# Altium project Telephone.PrjPcb (part 1 of 6)
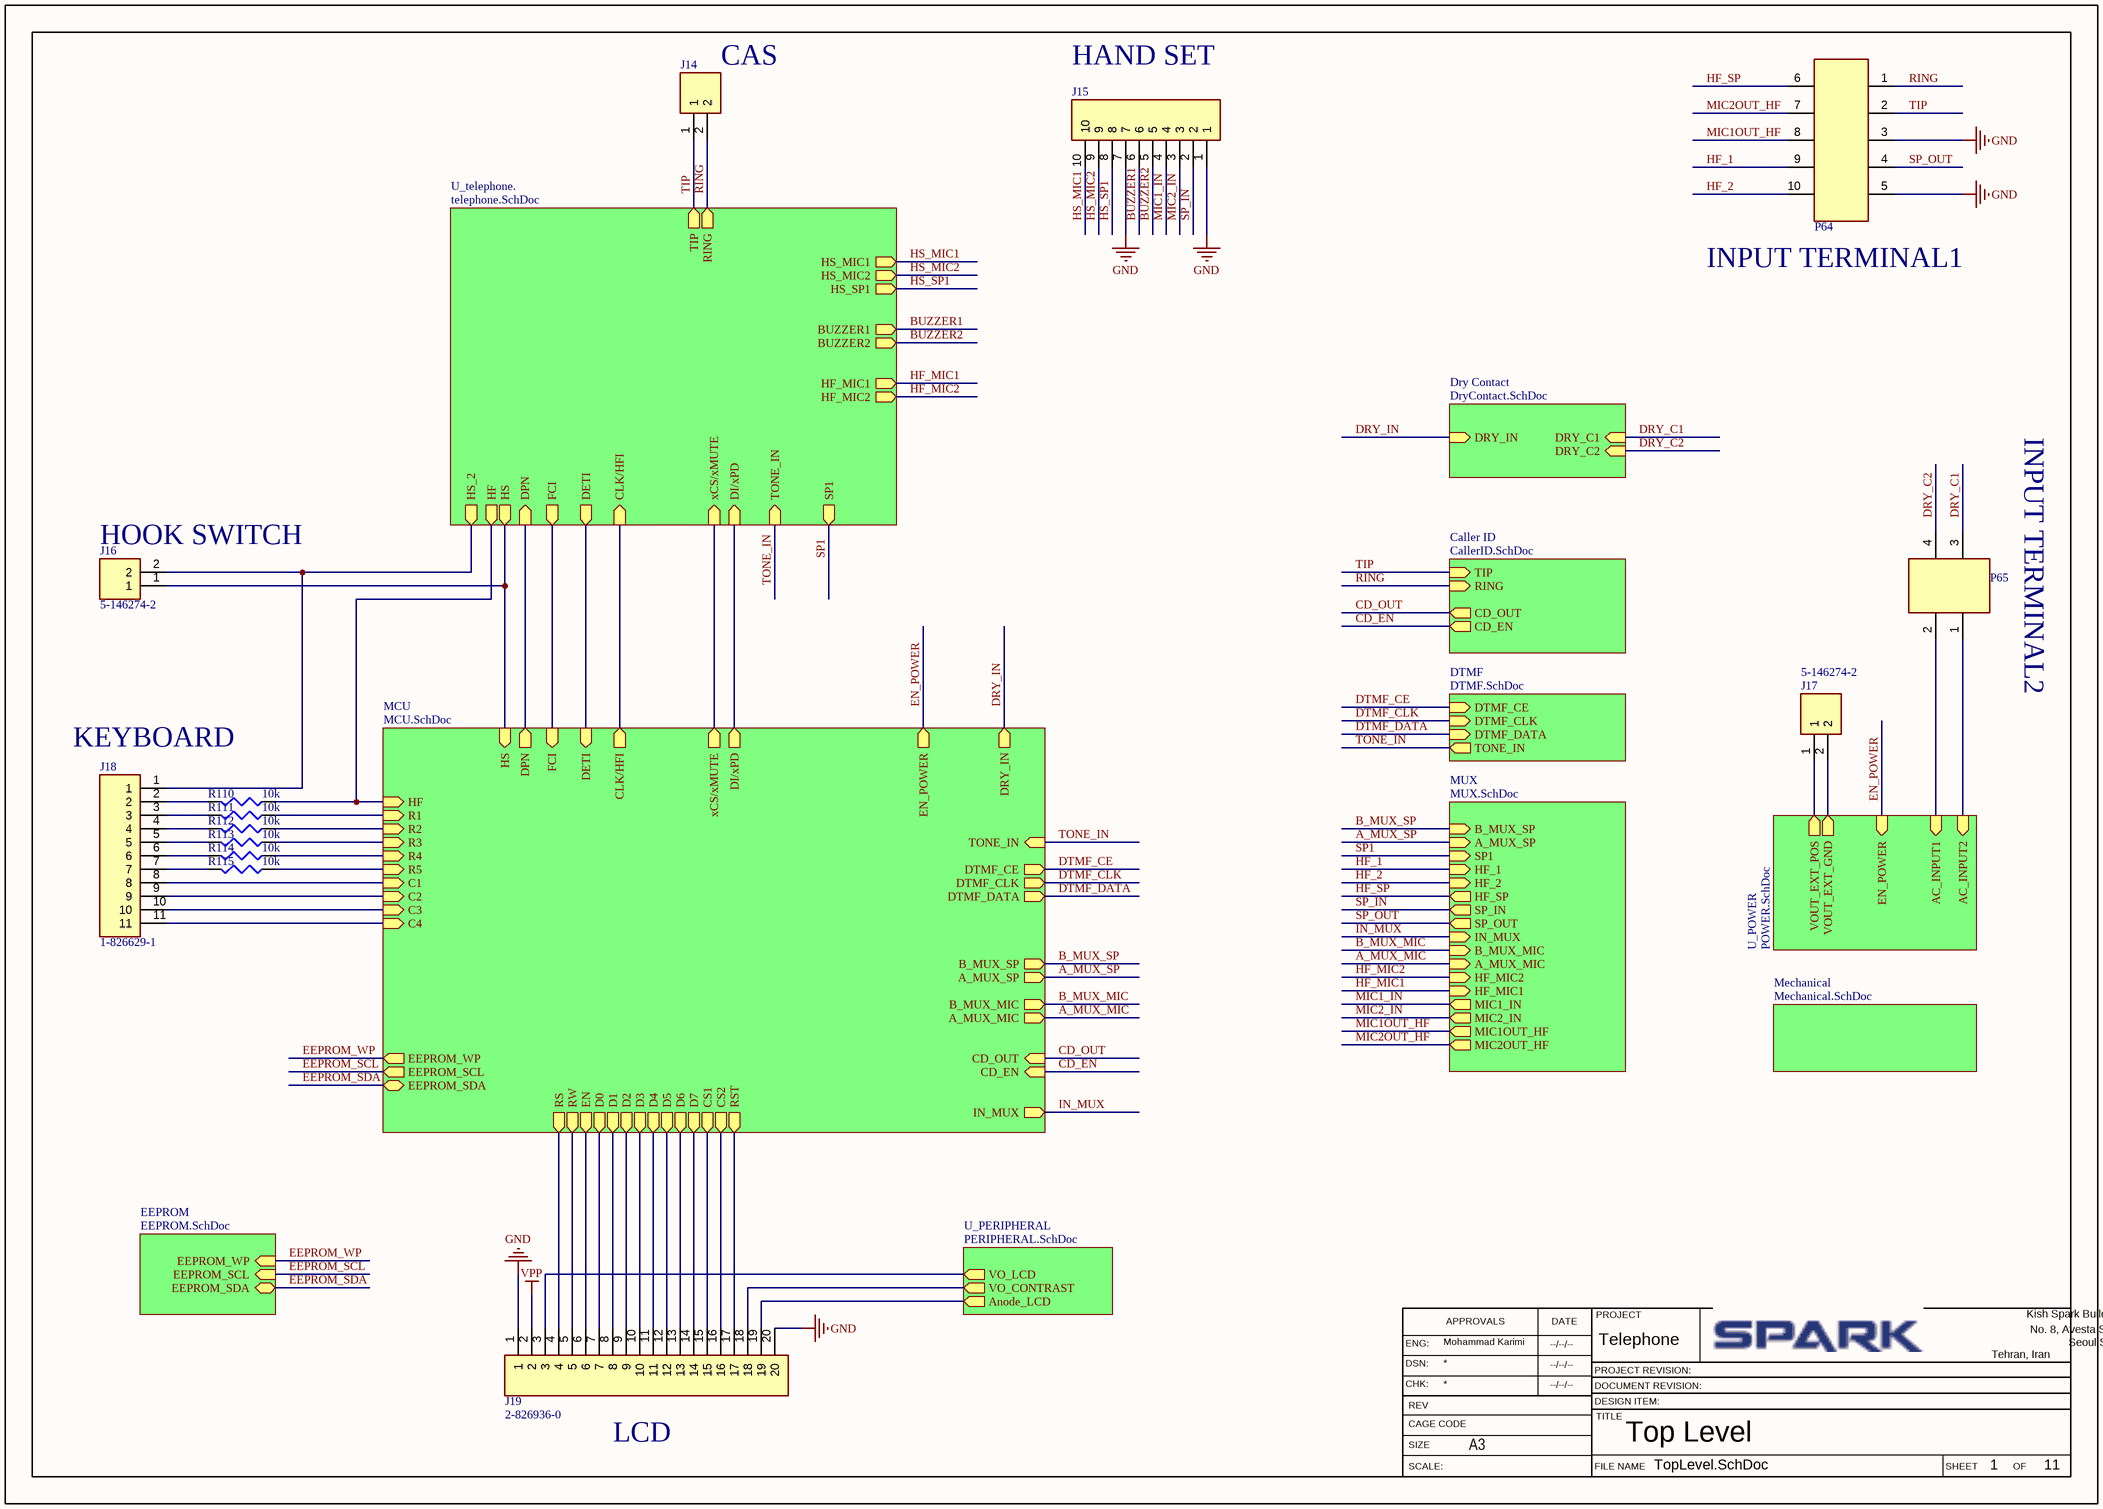
[diagram p0: TopLevel.SchDoc]
Engineer: Mohammad Karimi; Project: Telephone
11 sheets, 364 parts. Net scope: hierarchical (ports join the sheet entries above them; power ports are global).
Board file: PCB.PcbDoc
Sheets:
  TopLevel.SchDoc
    Dry Contact = DryContact.SchDoc
    U_telephone. = Telephone.SchDoc
    MCU = MCU.SchDoc
    U_POWER = Power.SchDoc
    U_PERIPHERAL = Peripheral.SchDoc
    Mechanical = Mechanical.SchDoc
    EEPROM = EEPROM.SchDoc
    Caller ID = CallerID.SchDoc
    DTMF = DTMF.SchDoc
    MUX = MUX.SchDoc

## Sheet TopLevel.SchDoc: Top Level
size A3; Organization: ORGANIZATION; Address1: ADDRESS 1; Address2: ADDRESS 2; Address3: ADDRESS 3; Address4: ADDRESS 4; Revision: -; SheetNumber: 1; SheetTotal: 11; ENG_APP_DATE: --/--/--; DSN_APP_DATE: --/--/--; CHK_APP_DATE: --/--/--

### Parts
J14  5-146274-2  [TE_5-146274-2]  (value not drawn)
J15  146443-5  [146443-5]  (value not drawn)
J16  5-146274-2  [TE_5-146274-2]
J17  5-146274-2  [TE_5-146274-2]
J18  1-826629-1  [1-826629-1]
J19  2-826936-0  [2-826936-0]
P64  66201021122  [POWER 10 PIN]  (value not drawn)
P65  66200421122  [power-4pin]  (value not drawn)
R110  value 10k  [R0603]  (hidden comment: CRCW060310K0JNEA)
R111  value 10k  [R0603]  (hidden comment: CRCW060310K0JNEA)
R112  value 10k  [R0603]  (hidden comment: CRCW060310K0JNEA)
R113  value 10k  [R0603]  (hidden comment: CRCW060310K0JNEA)
R114  value 10k  [R0603]  (hidden comment: CRCW060310K0JNEA)
R115  value 10k  [R0603]  (hidden comment: CRCW060310K0JNEA)

### Sub-sheets
Caller ID = CallerID.SchDoc: CD_OUT (out), TIP (in), RING (in), CD_EN (out)
Dry Contact = DryContact.SchDoc: DRY_C2 (in), DRY_C1 (in), DRY_IN (in)
DTMF = DTMF.SchDoc: DTMF_CE (in), DTMF_CLK (in), DTMF_DATA (in), TONE_IN (out)
EEPROM = EEPROM.SchDoc: EEPROM_WP (in), EEPROM_SCL (in), EEPROM_SDA (bidir)
MCU = MCU.SchDoc: DI/xPD (out), xCS/xMUTE (out), DPN (out), CLK/HFI (out), DETI (in), DTMF_CE (out), DTMF_CLK (out), DTMF_DATA (out), TONE_IN (in), R1 (in), R2 (in), R3 (in), R4 (in), R5 (in), C1 (in), C2 (in), C3 (in), C4 (in), HF (in), HS (in), FCI (in), B_MUX_SP (out), A_MUX_SP (out), B_MUX_MIC (out), A_MUX_MIC (out), CD_EN (in), CD_OUT (in), CS2 (out), D4 (out), D5 (out), EN (out), D6 (out), D2 (out), CS1 (out), D3 (out), D1 (out), RS (out), D0 (out), RST (out), D7 (out), RW (out), DRY_IN (out), EN_POWER (out), IN_MUX (out), EEPROM_WP (out), EEPROM_SCL (out), EEPROM_SDA (bidir)
Mechanical = Mechanical.SchDoc: no entries
MUX = MUX.SchDoc: B_MUX_SP (in), A_MUX_SP (in), SP1 (in), HF_1 (in), HF_2 (in), HF_SP (out), SP_IN (out), SP_OUT (out), IN_MUX (in), B_MUX_MIC (in), A_MUX_MIC (in), HF_MIC2 (in), HF_MIC1 (in), MIC1_IN (out), MIC2_IN (out), MIC1OUT_HF (out), MIC2OUT_HF (out)
U_PERIPHERAL = PERIPHERAL.SchDoc: VO_LCD (out), VO_CONTRAST (out), Anode_LCD (out)
U_POWER = POWER.SchDoc: EN_POWER (in), VOUT_EXT_POS (out), AC_INPUT1 (in), AC_INPUT2 (in), VOUT_EXT_GND (out)
U_telephone. = telephone.SchDoc: HF (out), HS (out), DI/xPD (in), xCS/xMUTE (in), DPN (in), FCI (out), TONE_IN (in), DETI (out), CLK/HFI (in), TIP (out), RING (out), SP1 (out), HS_SP1 (out), HS_2 (out), BUZZER1 (out), BUZZER2 (out), HF_MIC2 (out), HF_MIC1 (out), HS_MIC1 (out), HS_MIC2 (out)

### Nets
GND: J15.1 J15.7 J19.1 J19.20 P64.3 P64.5
VPP: J19.2
A_MUX_MIC: sheet MCU/A_MUX_MIC, sheet MUX/A_MUX_MIC
A_MUX_SP: sheet MCU/A_MUX_SP, sheet MUX/A_MUX_SP
Anode_LCD: J19.19 ; sheet U_PERIPHERAL/Anode_LCD
B_MUX_MIC: sheet MCU/B_MUX_MIC, sheet MUX/B_MUX_MIC
B_MUX_SP: sheet MCU/B_MUX_SP, sheet MUX/B_MUX_SP
BUZZER1: J15.6 ; sheet U_telephone./BUZZER1
BUZZER2: J15.5 ; sheet U_telephone./BUZZER2
C1: J18.8 ; sheet MCU/C1
C2: J18.9 ; sheet MCU/C2
C3: J18.10 ; sheet MCU/C3
C4: J18.11 ; sheet MCU/C4
CD_EN: sheet MCU/CD_EN, sheet Caller ID/CD_EN
CD_OUT: sheet MCU/CD_OUT, sheet Caller ID/CD_OUT
CLK/HFI: sheet U_telephone./CLK/HFI, sheet MCU/CLK/HFI
CS1: J19.15 ; sheet MCU/CS1
CS2: J19.16 ; sheet MCU/CS2
D0: J19.7 ; sheet MCU/D0
D1: J19.8 ; sheet MCU/D1
D2: J19.9 ; sheet MCU/D2
D3: J19.10 ; sheet MCU/D3
D4: J19.11 ; sheet MCU/D4
D5: J19.12 ; sheet MCU/D5
D6: J19.13 ; sheet MCU/D6
D7: J19.14 ; sheet MCU/D7
DETI: sheet U_telephone./DETI, sheet MCU/DETI
DI/xPD: sheet U_telephone./DI/xPD, sheet MCU/DI/xPD
DPN: sheet U_telephone./DPN, sheet MCU/DPN
DRY_C1: P65.3 ; sheet Dry Contact/DRY_C1
DRY_C2: P65.4 ; sheet Dry Contact/DRY_C2
DRY_IN: sheet Dry Contact/DRY_IN, sheet MCU/DRY_IN
DTMF_CE: sheet MCU/DTMF_CE, sheet DTMF/DTMF_CE
DTMF_CLK: sheet MCU/DTMF_CLK, sheet DTMF/DTMF_CLK
DTMF_DATA: sheet MCU/DTMF_DATA, sheet DTMF/DTMF_DATA
EEPROM_SCL: sheet MCU/EEPROM_SCL, sheet EEPROM/EEPROM_SCL
EEPROM_SDA: sheet MCU/EEPROM_SDA, sheet EEPROM/EEPROM_SDA
EEPROM_WP: sheet MCU/EEPROM_WP, sheet EEPROM/EEPROM_WP
EN: J19.6 ; sheet MCU/EN
EN_POWER: sheet MCU/EN_POWER, sheet U_POWER/EN_POWER
FCI: sheet U_telephone./FCI, sheet MCU/FCI
HF: R110.1 ; sheet U_telephone./HF, sheet MCU/HF
HF_1: P64.9 ; sheet MUX/HF_1
HF_2: P64.10 ; sheet MUX/HF_2
HF_MIC1: sheet U_telephone./HF_MIC1, sheet MUX/HF_MIC1
HF_MIC2: sheet U_telephone./HF_MIC2, sheet MUX/HF_MIC2
HF_SP: P64.6 ; sheet MUX/HF_SP
HS: J16.1 ; sheet U_telephone./HS, sheet MCU/HS
HS_2: J16.2 J18.1 ; sheet U_telephone./HS_2
HS_MIC1: J15.10 ; sheet U_telephone./HS_MIC1
HS_MIC2: J15.9 ; sheet U_telephone./HS_MIC2
HS_SP1: J15.8 ; sheet U_telephone./HS_SP1
IN_MUX: sheet MCU/IN_MUX, sheet MUX/IN_MUX
MIC1_IN: J15.4 ; sheet MUX/MIC1_IN
MIC1OUT_HF: P64.8 ; sheet MUX/MIC1OUT_HF
MIC2_IN: J15.3 ; sheet MUX/MIC2_IN
MIC2OUT_HF: P64.7 ; sheet MUX/MIC2OUT_HF
R1: R111.1 ; sheet MCU/R1
R2: R112.1 ; sheet MCU/R2
R3: R113.1 ; sheet MCU/R3
R4: R114.1 ; sheet MCU/R4
R5: R115.1 ; sheet MCU/R5
RING: J14.2 P64.1 ; sheet U_telephone./RING, sheet Caller ID/RING
RS: J19.4 ; sheet MCU/RS
RST: J19.17 ; sheet MCU/RST
RW: J19.5 ; sheet MCU/RW
SP1: sheet U_telephone./SP1, sheet MUX/SP1
SP_IN: J15.2 ; sheet MUX/SP_IN
SP_OUT: P64.4 ; sheet MUX/SP_OUT
TIP: J14.1 P64.2 ; sheet U_telephone./TIP, sheet Caller ID/TIP
TONE_IN: sheet U_telephone./TONE_IN, sheet MCU/TONE_IN, sheet DTMF/TONE_IN
VO_CONTRAST: J19.18 ; sheet U_PERIPHERAL/VO_CONTRAST
VO_LCD: J19.3 ; sheet U_PERIPHERAL/VO_LCD
xCS/xMUTE: sheet U_telephone./xCS/xMUTE, sheet MCU/xCS/xMUTE
NetJ17_1: J17.1 ; sheet U_POWER/VOUT_EXT_POS
NetJ17_2: J17.2 ; sheet U_POWER/VOUT_EXT_GND
NetJ18_2: J18.2 R110.2
NetJ18_3: J18.3 R111.2
NetJ18_4: J18.4 R112.2
NetJ18_5: J18.5 R113.2
NetJ18_6: J18.6 R114.2
NetJ18_7: J18.7 R115.2
NetP65_1: P65.1 ; sheet U_POWER/AC_INPUT2
NetP65_2: P65.2 ; sheet U_POWER/AC_INPUT1

### Notes on the sheet
- (near J14) CAS
- HAND SET
- (near P64) INPUT TERMINAL1
- INPUT TERMINAL2
- (near J16) HOOK SWITCH
- (near J18) KEYBOARD
- LCD
- APPROVALS
- DATE
- PROJECT
- Kish Spark Building
- No. 8, Avesta Street
- ENG:
- DSN:
- CHK:
- PROJECT REVISION:
- DESIGN ITEM:
- DOCUMENT REVISION:
- Tehran, Iran
- Seoul Street, Sheikh Bahaie
- SIZE
- REV
- SCALE:
- CAGE CODE
- A3
- FILE NAME
- TITLE
- SHEET
- OF

### Library data of the parts
J14 J16 J17 = CMP-002-00181-1: Conn Unshrouded Header HDR 2 POS 2.54mm Solder ST Top Entry Thru-Hole Carton; Connector Type: Plug,Header,Pin; Gender: Male; Voltage Rating: 750V; Approvals: CSA; Board Standoff: Yes (With); Contact Current Rating: 3A; Contact Post Length: 0.125inch; Contact Protection: No (Without); High Speed Serial Data Connector: No; High Temperature Housing: Yes; Max Voltage Rating (AC): 250V; Number of Contacts: 2; PCB Mount Retention: Without; PCB Mounting Orientation: Vertical; PCB Thickness: 0.062inch; Max Operating Temperature: 105°C; Min Operating Temperature: -65°C; Mounting Technology: Through Hole; RoHS Compliant: Yes; Color: Black; Contact Finish - Mating: TIN; Contact Gender: Male; Contact Material: Bronze; Contact Mating Length: 8.08mm; Contact Plating: Tin; Contact Shape: Square; Contact Type: Male Pin; Current Rating: 3A; Depth: 2.34mm; ELV: Compliant; Fastening Type: Pull; Flammability Rating: UL94 V-0; Gasket: No (Without); Housing Color: Black; Housing Material: Polymer; Insulation Color: Black; Insulation Material: Polymer; Keyed: No; Lead Free: Lead Free; Length: 2.67mm; Mating Alignment: No (Without); Mating Connector Lock: No (Without); Number of Positions: 2; Number of Rows: 1; Orientation: Straight; Package Quantity: 500; Packaging: Carton; Pitch: 2.54mm; Radiation Hardening: No; Reach SVHC Compliant: Unknown; Row Spacing: 2.54mm; Selectively Loaded: No (Without); Series: AMPMODU MOD II; Stabilizers: No (Without); Strain Relief: No (Without); Termination: Through Hole
J15 = CMP-002-00182-1: Conn Unshrouded Header HDR 10 POS 2.54mm Solder ST Thru-Hole Carton; Connector Type: Plug,Header,Pin; Board Standoff: No (Without); High Speed Serial Data Connector: No; Number of Contacts: 10; PCB Mount Retention: Without; PCB Mounting Orientation: Vertical; Plating Thickness: 5um; Mounting Technology: Surface Mount; RoHS Compliant: No; Contact Finish - Mating: GOLD; Contact Material: Copper Alloy; Contact Mating Length: 0.23inch; Contact Plating: Gold; Contact Protection: No (Without); Contact Shape: Square; Contact Type: Male Pin; ELV: Non-Compliant; Fastening Type: Pull; Gasket: No (Without); High Temperature Compatible: No; High Temperature Housing: No; Housing Color: Black; Housing Material: Thermoplastic; Keyed: No; Mating Alignment: No (Without); Mating Connector Lock: No (Without); Number of Positions: 10; Number of Rows: 2; Orientation: Vertical; Package Quantity: 320; Packaging: Carton; Pitch: 2.54mm; Radiation Hardening: No; Row Spacing: 2.54mm; Sealable: No (Without); Selectively Loaded: No (Without); Series: AMPMODU MOD II; Stabilizers: No (Without); Strain Relief: No (Without); Termination: SMD/SMT
J18 = CMP-002-00184-1: Conn Unshrouded Header HDR 11 POS 2.54mm Solder ST Thru-Hole Carton; Connector Type: Plug,Header,Pin; Board Standoff: No (Without); Contact Post Length: 0.1259inch; High Speed Serial Data Connector: No; Number of Contacts: 11; PCB Mount Retention: Without; PCB Mounting Orientation: Vertical; Plating Thickness: 0.8um; Max Operating Temperature: 105°C; Min Operating Temperature: -65°C; Mounting Technology: Straddle Mount; RoHS Compliant: Yes; Contact Finish - Mating: GOLD; Contact Gender: Male; Contact Material: Bronze; Contact Mating Length: 6.7mm; Contact Plating: Gold,Tin; Contact Protection: No (Without); Contact Shape: Square; Contact Type: Male Pin; ELV: Compliant; Fastening Type: Pull; Flammability Rating: UL94 V-0; Gasket: No (Without); High Temperature Housing: No; Housing Color: Green; Housing Material: PBT; Insulation Color: Green; Insulation Material: PBT; Keyed: No; Mating Alignment: No (Without); Mating Connector Lock: No (Without); Number of Positions: 11; Number of Rows: 1; Orientation: Straight; Package Quantity: 500; Packaging: Carton; Pitch: 2.54mm; Radiation Hardening: No; Row Spacing: 2.54mm; Selectively Loaded: No (Without); Series: AMPMODU MOD II; Stabilizers: No (Without); Strain Relief: No (Without); Termination: Through Hole
J19 = CMP-002-00183-1: Conn Unshrouded Header HDR 20 POS 2.54mm Solder ST Thru-Hole Box; Connector Type: Plug,Header,Pin; Board Standoff: No (Without); Contact Current Rating: 5A; Contact Post Length: 0.1259inch; High Speed Serial Data Connector: No; Number of Contacts: 20; PCB Mount Retention: Without; PCB Mounting Orientation: Vertical; Plating Thickness: 2um; Max Operating Temperature: 105°C; Min Operating Temperature: -65°C; Mounting Technology: Through Hole; RoHS Compliant: Yes; Color: Green; Contact Gender: Male; Contact Material: Bronze; Contact Mating Length: 5.8mm; Contact Plating: Tin; Contact Protection: No (Without); Contact Shape: Square; Contact Type: Male Pin; ELV: Compliant; Flammability Rating: UL94 V-0; Gasket: No (Without); High Temperature Housing: No; Housing Color: Green; Housing Material: PBT; Keyed: No; Mating Alignment: No (Without); Mating Connector Lock: No (Without); Number of Positions: 20; Number of Rows: 1; Package Quantity: 300; Packaging: Box; Pitch: 2.54mm; Radiation Hardening: No; Row Spacing: 2.54mm; Selectively Loaded: No (Without); Series: AMPMODU MOD II; Stabilizers: No (Without); Strain Relief: No (Without); Termination: Through Hole
P64 = CMP-002-00178-2: WR-MPC3; 3mm Pitch 10 Way 2 Row Shrouded Straight PCB Header; Through Hole; Manufacturer: Wurth Electronics; Current Rating: 5A; Voltage Rating: 250V; Number of Positions: 10; Insulation: Insulated; Insulation Resistance: 1GR; Gender: Receptacle; Manufacturer Part Number: 66201021122; Category: Headers and Wire Housings; Mounting Technology: Through Hole; Color: Black; Contact Material: Copper Alloy,Copper; Contact Plating: Tin; Housing Material: Nylon; Contact Shape: Square; Contact Finish - Mating: TIN; Insulation Material: Polymer; Insulation Color: Black; Min Operating Temperature: -25°C; Max Operating Temperature: 105°C; Number of Rows: 2; Fastening Type: Ramp; Packaging: Tray; Contact Gender: Male; Termination: Through Hole; Number of Contacts: 10; Connector Type: Header; Series: WR-MPC3; Contact Type: Male Pin; Length: 18.7mm; Width: 18.7mm; Height: 9.9mm; Pitch: 3mm; Flammability Rating: UL94 V-0; RoHS Compliant: Yes; Reach SVHC Compliant: Unknown; ComponentLink1URL: https://datasheet.ciiva.com/8043/624425-8043421.pdf?src-supplier=Element14; ComponentLink1Description: https://datasheet.ciiva.com/8043/624425-8043421.pdf?src-supplier=Element14; ComponentLink2URL: https://datasheet.ciiva.com/731/6620xx21122-731332.pdf?src-supplier=Digi-Key; ComponentLink2Description: https://datasheet.ciiva.com/731/6620xx21122-731332.pdf?src-supplier=Digi-Key; Pins: 10; Component Type: Standard
P65 = CMP-002-00177-2: WR-MPC3 Series; 3mm Pitch 4 Way 2 Row Shrouded Straight PCB Header; Through Hole; Manufacturer: Wurth Electronics; Current Rating: 5A; Voltage Rating: 250V; Number of Positions: 4; Insulation: Insulated; Insulation Resistance: 1GR; Gender: Receptacle; Row Spacing: 0.118inch; Manufacturer Part Number: 66200421122; Category: Headers and Wire Housings; Mounting Technology: Through Hole; Color: Black; Contact Material: Copper Alloy,Copper; Contact Plating: Tin; Housing Material: Nylon; Contact Shape: Square; Contact Finish - Mating: TIN; Insulation Material: Polymer; Insulation Color: Black; Min Operating Temperature: -25°C; Max Operating Temperature: 105°C; Number of Rows: 2; Fastening Type: Ramp; Packaging: Tray; Contact Gender: Male; Termination: Through Hole; Number of Contacts: 4; Connector Type: Header; Series: WR-MPC3; Contact Type: Male Pin; Length: 9.7mm; Width: 9.7mm; Height: 9.9mm; Pitch: 3mm; Flammability Rating: UL94 V-0; RoHS Compliant: Yes; Reach SVHC Compliant: Unknown; ComponentLink1URL: https://datasheet.ciiva.com/8043/624425-8043413.pdf?src-supplier=Element14; ComponentLink1Description: https://datasheet.ciiva.com/8043/624425-8043413.pdf?src-supplier=Element14; ComponentLink2URL: https://datasheet.ciiva.com/731/6620xx21122-731329.pdf?src-supplier=Digi-Key; ComponentLink2Description: https://datasheet.ciiva.com/731/6620xx21122-731329.pdf?src-supplier=Digi-Key; Case/Package: 63; Pins: 4; Design Item ID: 66200421122; Component Type: Standard
R110-R115 = CMP-009-00213-1: Res Thick Film 0603 10K Ohm 5% 1/10W 200ppm/C Molded SMD SMD Paper T/R; Manufacturer 1: Vishay Dale; Voltage Rating: 75V; Max Power Dissipation: 100mW; Temperature Coefficient: 200ppm/°C; Case/Package: 0603; Pins: 2; RoHS Compliant: Yes; Min Operating Temperature: -55°C; Max Operating Temperature: 155°C; Tolerance: 5%; Design Item ID: CRCW060310K0JNEA; Case Code (Metric): 1608; Category: Chip SMD Resistors; Construction: Rectangular; Contact Plating: Tin; Depth: 0.85mm; Features: Automotive AEC-Q200; Height: 0.02inch; Lead Free: Lead Free; Length: 1.55mm; Manufacturer Part Number 1: CRCW060310K0JNEA; Military Standard: Not; Mount: Surface Mount; Number of Terminations: 2; Package Quantity: 1; Packaging: Tape and Reel; Power Rating: 100mW; Pricing 1: 1=0.10000, 10=0.03300, 100=0.01360, 1000=0.00610, 2500=0.00529 (USD); Radiation Hardening: No; REACH SVHC: Unknown; Resistance Tolerance: 5%; Resistor Type: Thick Film; RoHS: Yes; Series: CRCW; Size Code: 0603; Source: PTZLib.SchLib; Stock 1: 41; Termination: SMD/SMT; Voltage Rating (DC): 75V; Weight: 7.1E-05oz; Width: 0.033inch; ComponentLink1Description: https://datasheet.ciiva.com/3256/dcrcwe3-3256943.pdf?src-supplier=Avnet; ComponentLink1URL: https://datasheet.ciiva.com/3256/dcrcwe3-3256943.pdf?src-supplier=Avnet; ComponentLink2Description: https://datasheet.ciiva.com/2461/dcrcwe3-2461971.pdf?src-supplier=Digi-Key; ComponentLink2URL: https://datasheet.ciiva.com/2461/dcrcwe3-2461971.pdf?src-supplier=Digi-Key; ComponentLink3Description: https://datasheet.ciiva.com/2461/dcrcwe3-2461972.pdf?src-supplier=Digi-Key; ComponentLink3URL: https://datasheet.ciiva.com/2461/dcrcwe3-2461972.pdf?src-supplier=Digi-Key; ComponentLink4Description: https://datasheet.ciiva.com/2461/dcrcwe3-2461973.pdf?src-supplier=Digi-Key; ComponentLink4URL: https://datasheet.ciiva.com/2461/dcrcwe3-2461973.pdf?src-supplier=Digi-Key; ComponentLink5Description: https://datasheet.ciiva.com/3256/dcrcwe3-3256942.pdf?src-supplier=Avnet; ComponentLink5URL: https://datasheet.ciiva.com/3256/dcrcwe3-3256942.pdf?src-supplier=Avnet; ComponentLink6Description: https://datasheet.ciiva.com/16343/dcrcwe3-16343525.pdf?src-supplier=Future+Electronics; ComponentLink6URL: https://datasheet.ciiva.com/16343/dcrcwe3-16343525.pdf?src-supplier=Future+Electronics; ComponentLink7Description: https://datasheet.ciiva.com/16755/70201119-16755717.pdf?src-supplier=Allied+Electronics; ComponentLink7URL: https://datasheet.ciiva.com/16755/70201119-16755717.pdf?src-supplier=Allied+Electronics; ComponentLink8Description: https://datasheet.ciiva.com/16515/dcrcwe3-16515020.pdf?src-supplier=Avnet+Asia; ComponentLink8URL: https://datasheet.ciiva.com/16515/dcrcwe3-16515020.pdf?src-supplier=Avnet+Asia; ComponentLink9Description: https://datasheet.ciiva.com/16771/70201119-16771051.pdf?src-supplier=Allied+Electronics; ComponentLink9URL: https://datasheet.ciiva.com/16771/70201119-16771051.pdf?src-supplier=Allied+Electronics

## Sheet DryContact.SchDoc: Dry Contact
size A4; Organization: ORGANIZATION; Address1: ADDRESS 1; Address2: ADDRESS 2; Address3: ADDRESS 3; Address4: ADDRESS 4; Revision: -; ENG_APP_DATE: --/--/--; DSN_APP_DATE: --/--/--; CHK_APP_DATE: --/--/--
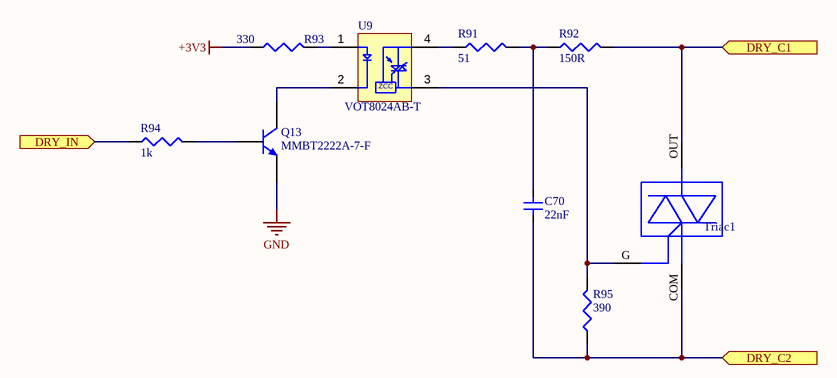
[diagram p1: DryContact.SchDoc]

### Parts
C70  value 22nF  [1206]  (hidden comment: CMP-001-00171-1)
Q13  MMBT2222A-7-F  [SOT23127P600-8N]
R91  value 51  [R0603]  (hidden comment: CMP-009-00208-1)
R92  value 150R  [R0603]  (hidden comment: CMP-009-00192-1)
R93  value 330  [R0603]  (hidden comment: RC0603FR-07330RL)
R94  value 1k  [R0603]  (hidden comment: CMP-009-00194-1)
R95  value 390  [R0603]  (hidden comment: CMP-009-00224-1)
Triac1  ACST210-8BTR  [ACST210_DPAK]  (value not drawn)
U9  VOT8024AB-T  [SW-TRIAC]

### Ports
DRY_C1 (in), DRY_C2 (in), DRY_IN (in)

### Nets
+3V3: R93.2
GND: Q13.1(E)
DRY_C1: R92.2 Triac1.OUT ; port DRY_C1
DRY_C2: C70.1 R95.1 Triac1.COM ; port DRY_C2
DRY_IN: R94.1 ; port DRY_IN
NetC70_2: C70.2 R91.2 R92.1
NetQ13_2: Q13.2(B) R94.2
NetQ13_3: Q13.3(C) U9.2(C)
NetR91_1: R91.1 U9.4(MT2)
NetR93_1: R93.1 U9.1(A)
NetR95_2: R95.2 Triac1.G U9.3(MT1)

### Notes on the sheet
- APPROVALS
- DATE
- PROJECT
- Kish Spark Building
- No. 8, Avesta Street
- ENG:
- DSN:
- CHK:
- PROJECT REVISION:
- DESIGN ITEM:
- DOCUMENT REVISION:
- Tehran, Iran
- Seoul Street, Sheikh Bahaie
- SIZE
- REV
- SCALE:
- CAGE CODE
- A4
- FILE NAME
- TITLE
- SHEET
- OF
- (in symbol CMP-076-000009-2) ZCC

### Library data of the parts
C70 = CMP-001-00171-1: Capacitor SMD Ceramic 1206 400Vdc X7R Dielectric 0.022uF ±10% 125°C T/R; Manufacturer: Kyocera AVX; Manufacturer Part Number: 12068C223KAT2A; Voltage Rating (DC): 400V; RoHS: Yes; Category: Ceramic Capacitors; Stock 1: 2302; Pricing 1: 1=0.72, 10=0.531, 50=0.531, 100=0.364, 1000=0.243, 10000=0.215 (USD); Min Operating Temperature: -55°C; Max Operating Temperature: 125°C; Package Quantity: 2000; Tolerance: 10%; Packaging: Tape and Reel; Dielectric: X7R; ComponentLink1URL: http://www.mouser.com/ds/2/40/X7RDielectric-777024.pdf?src-supplier=Mouser; ComponentLink1Description: http://www.mouser.com/ds/2/40/X7RDielectric-777024.pdf?src-supplier=Mouser; Design Item ID: 12068C223KAT2A; Component Type: Standard; Pin Count: 2; Source: V4-TEL.SCHLIB
Q13 = CMP-012-00003-2: MMBT2222 Series NPN 350 mW 40 V 600 mA SMT Small Signal Transistor - SOT-23; Manufacturer: Diodes; Current Rating: 600mA; Voltage Rating: 40V; Collector Base Voltage (VCBO): 75V; Collector Emitter Saturation Voltage: 1V; Current: 1A; Element Configuration: Single; Emitter Base Voltage (VEBO): 6V; Frequency: 300MHz; hFE Min: 100; Max Power Dissipation: 300mW; Number of Elements: 1; Power Dissipation: 350mW; Case/Package: SOT-23-3; Pins: 3; RoHS Compliant: Yes; Min Operating Temperature: -55°C; Max Operating Temperature: 150°C; Design Item ID: MMBT2222A-7-F; Category: BJTs; Collector Emitter Breakdown Voltage: 40V; Collector Emitter Voltage (VCEO): 40V; Collector-emitter Voltage-Max: 1V; Component Type: Standard; Contact Plating: Tin,Matte; Continuous Collector Current: 600mA; Gain Bandwidth Product: 300MHz; Height: 1mm; Lead Free: Lead Free; Length: 3.05mm; Manufacturer Part Number: MMBT2222A-7-F; Max Collector Current: 600mA; Max Frequency: 300MHz; Mount: Surface Mount; Package Quantity: 3000; Packaging: Tape and Reel; Pin Count: 3; Polarity: NPN; Pricing 1: 1=0.14000, 10=0.13300, 50=0.13300, 100=0.07200, 500=0.04500, 1000=0.03100, 3000=0.02300, 9000=0.02000, 10000=0.02000, 24000=0.01800, 45000=0.01500 (USD); Radiation Hardening: No; Reach SVHC Compliant: Yes; RoHS: Yes; Series: Automotive, AEC-Q101; Source: PTZ.SCHLIB; Stock 1: 1743698; Termination: SMD/SMT; Transition Frequency: 300MHz; Voltage: 40V; Voltage Rating (DC): 40V; Weight: 0.000282oz; Width: 1.4mm; ComponentLink1Description: https://datasheet.ciiva.com/15139/getdatasheetpartid-82692-15139078.pdf?src-supplier=Verical; ComponentLink1URL: https://datasheet.ciiva.com/15139/getdatasheetpartid-82692-15139078.pdf?src-supplier=Verical; ComponentLink2Description: https://datasheet.ciiva.com/8029/ds30041-8029709.pdf?src-supplier=Element14; ComponentLink2URL: https://datasheet.ciiva.com/8029/ds30041-8029709.pdf?src-supplier=Element14; ComponentLink3Description: https://datasheet.ciiva.com/11201/ds30041-11201864.pdf?src-supplier=Avnet; ComponentLink3URL: https://datasheet.ciiva.com/11201/ds30041-11201864.pdf?src-supplier=Avnet; ComponentLink4Description: https://datasheet.ciiva.com/16199/ds30041-16199045.pdf?src-supplier=Future+Electronics; ComponentLink4URL: https://datasheet.ciiva.com/16199/ds30041-16199045.pdf?src-supplier=Future+Electronics; ComponentLink5Description: https://datasheet.ciiva.com/11198/ds30041-11198965.pdf?src-supplier=Avnet; ComponentLink5URL: https://datasheet.ciiva.com/11198/ds30041-11198965.pdf?src-supplier=Avnet; ComponentLink6Description: https://datasheet.ciiva.com/972/ds30041-972551.pdf?src-supplier=Digi-Key; ComponentLink6URL: https://datasheet.ciiva.com/972/ds30041-972551.pdf?src-supplier=Digi-Key; ComponentLink7Description: https://datasheet.ciiva.com/972/ds30041-972552.pdf?src-supplier=Digi-Key; ComponentLink7URL: https://datasheet.ciiva.com/972/ds30041-972552.pdf?src-supplier=Digi-Key; ComponentLink8Description: https://datasheet.ciiva.com/972/ds30041-972550.pdf?src-supplier=Digi-Key; ComponentLink8URL: https://datasheet.ciiva.com/972/ds30041-972550.pdf?src-supplier=Digi-Key
R91 = CMP-009-00208-1: Thick Film Resistors - SMD 0.2W 51ohm 1% 100ppm; Manufacturer 1: KOA Speer; Manufacturer Part Number 1: SG73S1JTTD51R0F; Power Rating: 200mW; Voltage Rating: 50V; Temperature Coefficient: 100ppm/°C; RoHS: Yes; Category: Chip SMD Resistors; Stock 1: 9823; Pricing 1: 1=0.20000, 10=0.13500, 50=0.13500, 100=0.05100, 1000=0.02400, 10000=0.01500 (USD); Case/Package: 0603; Case Code (Metric): 1608; Min Operating Temperature: -55°C; Max Operating Temperature: 155°C; Packaging: Tape and Reel; Package Quantity: 5000; Tolerance: 1%; Resistor Type: Thick Film; Termination: SMD/SMT; Voltage Rating (DC): 50V; Series: SG73; Length: 1.6mm; Width: 0.8mm; Height: 0.45mm; RoHS Compliant: Yes; ComponentLink1URL: http://www.koaspeer.com/catimages/Products/SG73/SG73.pdf?src-supplier=Mouser; ComponentLink1Description: http://www.koaspeer.com/catimages/Products/SG73/SG73.pdf?src-supplier=Mouser; Pins: 2; Design Item ID: SG73S1JTTD51R0F; Source: PTZLib.SchLib
R92 = CMP-009-00192-1: TE CONNECTIVITY - CRGP0603F150R - Chipwiderstand, Oberflächenmontage, 0603 [Metrisch 1608], 150 ohm, CRGP Series, 50 V, Dickschicht; RoHS: Yes; Category: Chip SMD Resistors; Stock 1: 18693; Pricing 1: 1=0.17000, 10=0.14800, 100=0.05780, 1000=0.02420, 2500=0.02218 (USD); ComponentLink1URL: https://4donline.ihs.com/images/VipMasterIC/IC/TYEL/TYEL-S-A0005460475/TYEL-S-A0005460475-1.pdf?hkey=52A5661711E402568146F3353EA87419&src-supplier=Farnell; ComponentLink1Description: https://4donline.ihs.com/images/VipMasterIC/IC/TYEL/TYEL-S-A0005460475/TYEL-S-A0005460475-1.pdf?hkey=52A5661711E402568146F3353EA87419&src-supplier=Farnell; ComponentLink2URL: https://4donline.ihs.com/images/VipMasterIC/IC/TYEL/TYEL-S-A0005460475/TYEL-S-A0005460475-1.pdf?hkey=52A5661711E402568146F3353EA87419&src-supplier=Newark; ComponentLink2Description: https://4donline.ihs.com/images/VipMasterIC/IC/TYEL/TYEL-S-A0005460475/TYEL-S-A0005460475-1.pdf?hkey=52A5661711E402568146F3353EA87419&src-supplier=Newark; RoHS Compliant: Yes; Design Item ID: CRGP0603F150R; Manufacturer 1: TE Connectivity; Manufacturer Part Number 1: CRGP0603F150R; Source: PTZLib.SchLib
R93 = CMP-009-00242-1: Res Thick Film 0603 330 Ohm 1% 0.1W(1/10W) ±100ppm/C Pad SMD T/R; Manufacturer: Yageo; Manufacturer Part Number: RC0603FR-071K54L; Voltage Rating: 50V; Max Power Dissipation: 100mW; Temperature Coefficient: 100ppm/°C; Case/Package: 0603; RoHS Compliant: Yes; Min Operating Temperature: -55°C; Max Operating Temperature: 155°C; Tolerance: 1%; Design Item ID: RC0603FR-071K54L; Case Code (Metric): 1608; Category: Chip SMD Resistors; Construction: Rectangular; Depth: 0.8mm; Features: Moisture Resistant; Height: 450um; Lead Free: Lead Free; Length: 1.6mm; Military Standard: Not; Number of Terminations: 2; Package Quantity: 1; Packaging: Cut Tape; Power Rating: 100mW; Pricing 1: 1=0.10000, 10=0.01800, 50=0.01800, 100=0.00600, 1000=0.00500, 10000=0.00300 (USD); Resistor Type: Thick Film; RoHS: Yes; Series: RC; Size Code: 0603; Stock 1: 61319; Termination: SMD/SMT; Voltage Rating (DC): 50V; Width: 800um; ComponentLink1Description: https://datasheet.ciiva.com/2454/pyu-r-int-thick-7-2454405.pdf?src-supplier=Digi-Key; ComponentLink1URL: https://datasheet.ciiva.com/2454/pyu-r-int-thick-7-2454405.pdf?src-supplier=Digi-Key; ComponentLink2Description: https://datasheet.ciiva.com/2454/pyu-r-int-thick-7-2454406.pdf?src-supplier=Digi-Key; ComponentLink2URL: https://datasheet.ciiva.com/2454/pyu-r-int-thick-7-2454406.pdf?src-supplier=Digi-Key; ComponentLink3Description: https://datasheet.ciiva.com/2454/pyu-r-int-thick-7-2454407.pdf?src-supplier=Digi-Key; ComponentLink3URL: https://datasheet.ciiva.com/2454/pyu-r-int-thick-7-2454407.pdf?src-supplier=Digi-Key; Pins: 2
R94 = CMP-009-00194-1: Res Thick Film 0603 1K Ohm 1% 1/10W ±100ppm/°C Molded SMD Paper T/R; Manufacturer: Yageo; Manufacturer Part Number: AC0603FR-071KL; Power Rating: 100mW; Voltage Rating: 50V; RoHS: Yes; Category: Chip SMD Resistors; Stock 1: 617396; Pricing 1: 1=0.10000, 10=0.02900, 50=0.02900, 100=0.01200, 1000=0.00500, 10000=0.00300 (USD); Case/Package: 0603; Case Code (Metric): 1608; Size Code: 0603; Min Operating Temperature: -55°C; Max Operating Temperature: 155°C; Tolerance: 1%; Packaging: Tape and Reel; Package Quantity: 1; Resistor Type: Thick Film; Number of Terminations: 2; Termination: SMD/SMT; Max Power Dissipation: 100mW; Temperature Coefficient: 100ppm/°C; Features: Moisture Resistant,Automotive AEC-Q200,Anti-Sulfur; Series: AC; Construction: Rectangular; Length: 0.063inch; Width: 0.031inch; Height: 0.022inch; Depth: 0.8mm; Military Standard: Not; Lead Free: Lead Free; RoHS Compliant: Yes; ComponentLink1URL: https://datasheet.ciiva.com/5558/pyu-ac-51-rohs-l-2-5558269.pdf?src-supplier=Mouser; ComponentLink1Description: https://datasheet.ciiva.com/5558/pyu-ac-51-rohs-l-2-5558269.pdf?src-supplier=Mouser; Design Item ID: AC0603FR-071KL; Source: PTZLib.SchLib
R95 = CMP-009-00224-1: Res Thick Film 0603 390 Ohm 1% 1/10W 100ppm/C Molded SMD Paper T/R; Manufacturer 1: Yageo; Manufacturer Part Number 1: RC0603FR-13390RL; Temperature Coefficient: 100ppm/°C; Power Rating: 100mW; Voltage Rating: 50V; RoHS: Yes; Category: Chip SMD Resistors; Stock 1: 12402; Case/Package: 0603; Contact Plating: Tin,Matte; Case Code (Metric): 1608; Min Operating Temperature: -55°C; Max Operating Temperature: 155°C; Tolerance: 1%; Resistor Type: Thick Film; Packaging: Tape and Reel; Termination: SMD/SMT; Series: RC; Construction: Rectangular; Length: 1.6mm; Width: 0.8mm; Height: 0.45mm; Depth: 0.8mm; Military Standard: Not; RoHS Compliant: Yes; ComponentLink1URL: https://datasheet.ciiva.com/8885/pyu-rc0603-51-rohs-l-4-8885886.pdf?src-supplier=Avnet; ComponentLink1Description: https://datasheet.ciiva.com/8885/pyu-rc0603-51-rohs-l-4-8885886.pdf?src-supplier=Avnet; Pricing 1: 1=0.10000, 10=0.02500, 50=0.02500, 100=0.01100, 1000=0.00500, 10000=0.00400 (USD); Design Item ID: RC0603FR-13390RL; Source: PTZLib.SchLib
Triac1 = CMP-011-00014-1: Triacs Triac Crowbar 10mA Switch 2A 800V; Manufacturer 1: STMicroelectronics; Element Configuration: Single; RoHS: Yes; Category: TRIACs; Pricing 1: 1=0.75000, 10=0.65700 (USD); Mount: Surface Mount; Case/Package: DPAK; Weight: 0.009185oz; Min Operating Temperature: -40°C; Max Operating Temperature: 125°C; Packaging: Tape and Reel; Package Quantity: 2500; RMS Current (Irms): 2A; Hold Current: 10mA; Series: ACS™/A.S.D®; Radiation Hardening: No; Lead Free: Lead Free; RoHS Compliant: Yes; ComponentLink1URL: https://datasheet.ciiva.com/15140/getdatasheetpartid-256875-15140675.pdf?src-supplier=Verical; ComponentLink1Description: https://datasheet.ciiva.com/15140/getdatasheetpartid-256875-15140675.pdf?src-supplier=Verical; Pins: 3; Voltage Rating: 800V; Design Item ID: ACST210-8BTR; Contact Plating: Tin,Matte; Manufacturer Part Number 1: ACST210-8BTR; Source: PTZLib.SchLib; Stock 1: 60; ComponentLink2Description: https://datasheet.ciiva.com/17423/cd00153575-17423141.pdf?src-supplier=Avnet+Europe; ComponentLink2URL: https://datasheet.ciiva.com/17423/cd00153575-17423141.pdf?src-supplier=Avnet+Europe
U9 = CMP-076-000009-2: Optocoupler Triac AC-OUT 1-Channel 800VDRM 4-Pin Surface Mount T/R; Manufacturer: Vishay; Number of Channels: 1; RMS Current (Irms): 100mA; Hold Current: 400uA; Forward Voltage: 1.2V; Manufacturer Part Number: VOT8024AB-T; RoHS: Yes; Case/Package: SMD/SMT; Min Operating Temperature: -55°C; Max Operating Temperature: 110°C; Series: -; Packaging: Cut Tape; RoHS Compliant: Yes; Design Item ID: VOT8024AB-T; Component Type: Standard; Mounting Technology: Surface Mount; Pins: 4

## Sheet Telephone.SchDoc
size A1; SheetNumber: 5; SheetTotal: 11
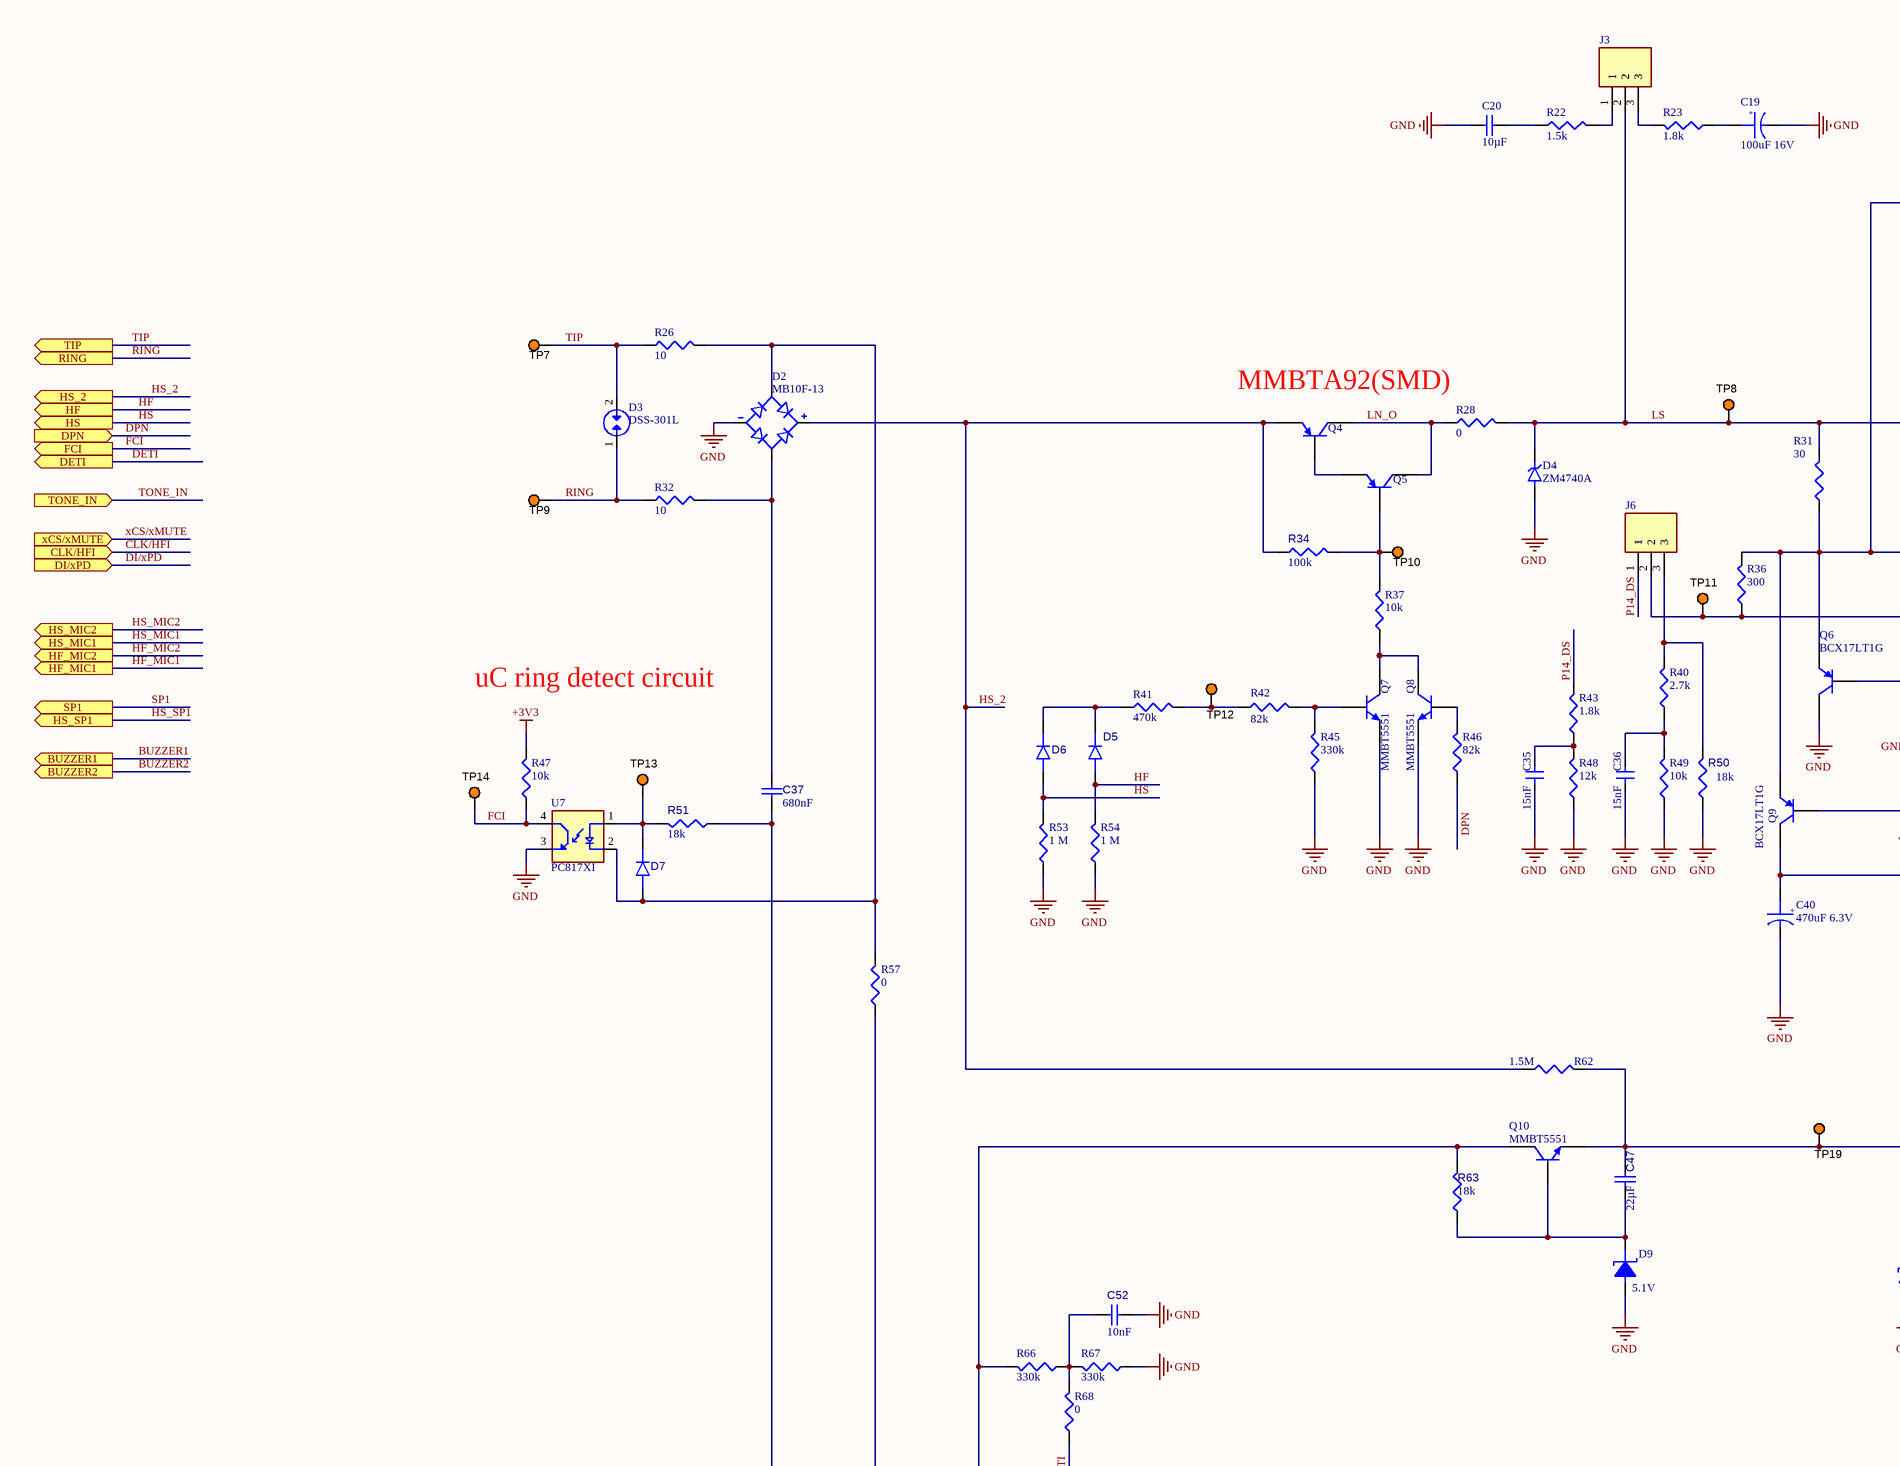
[diagram p2: Telephone.SchDoc, top left]
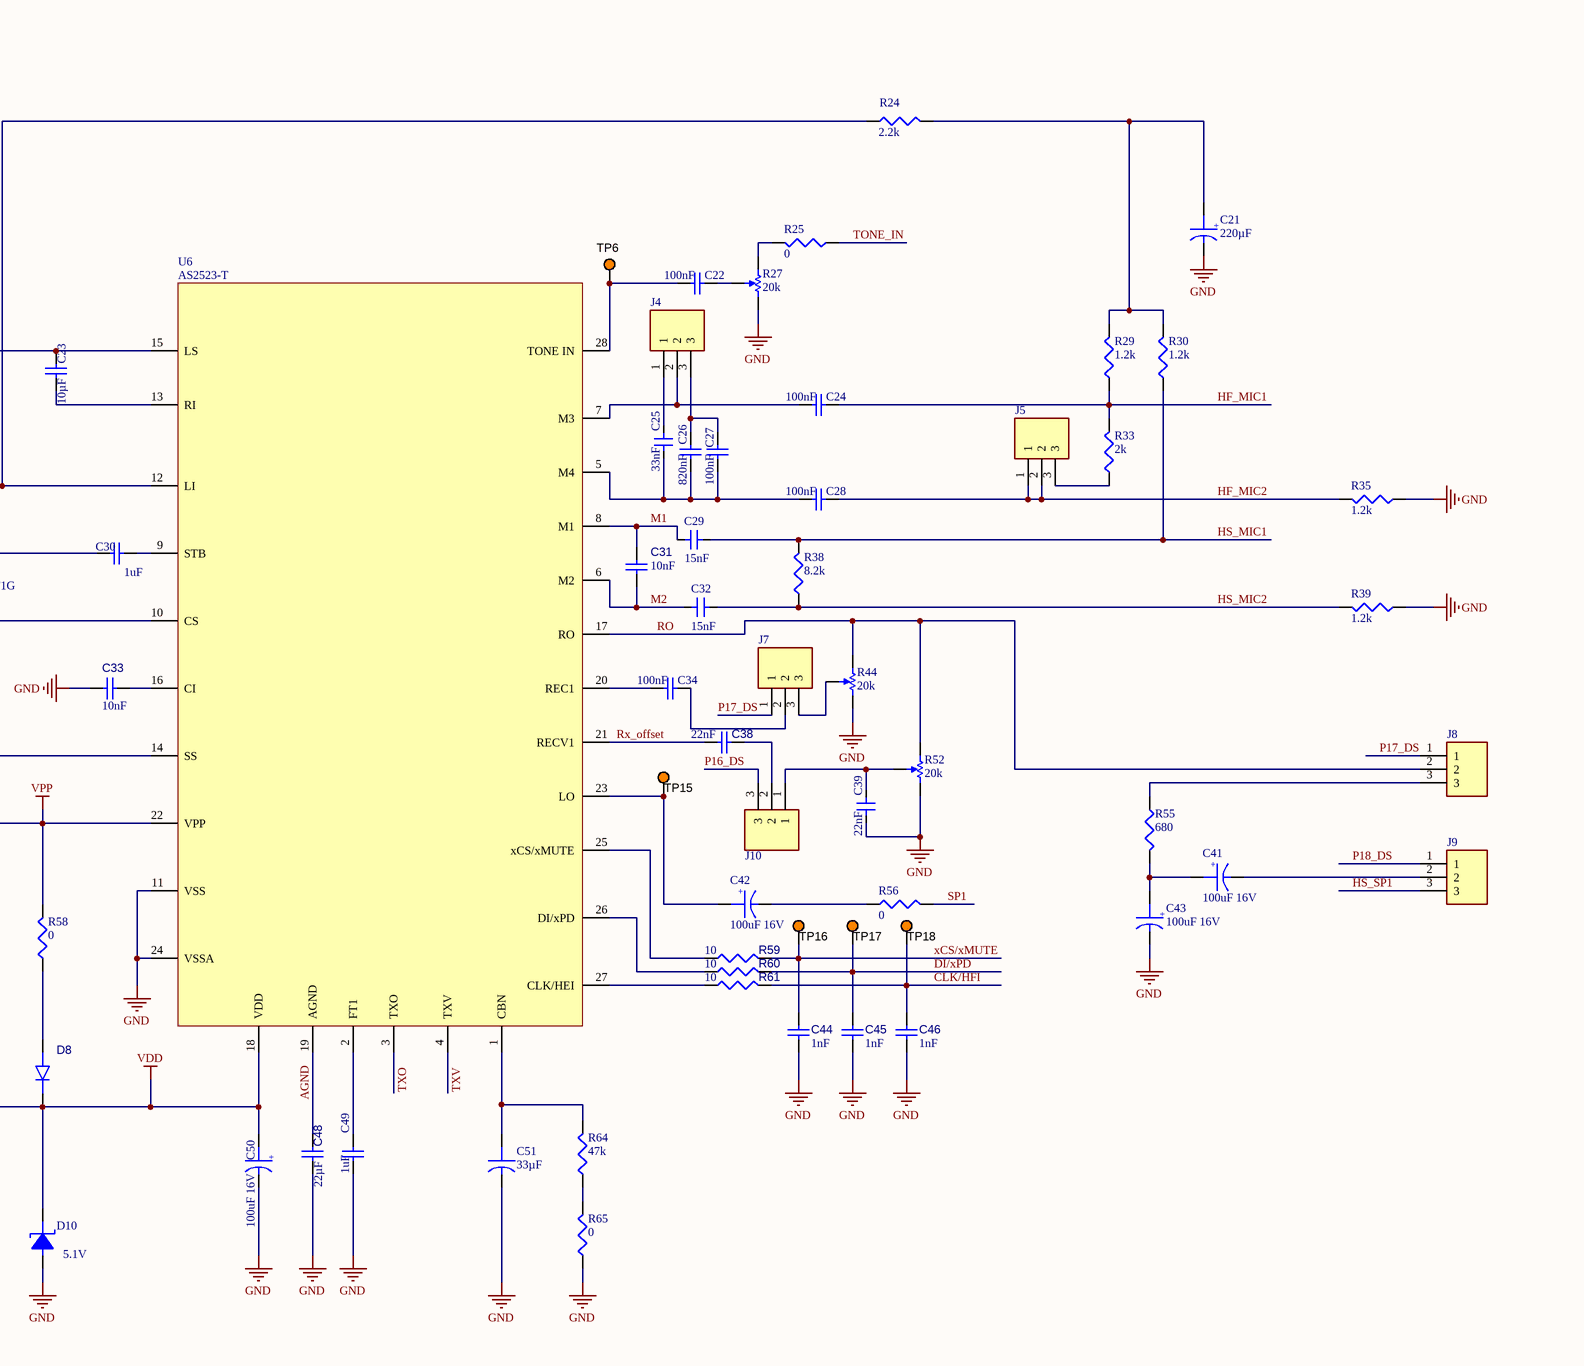
[diagram p3: Telephone.SchDoc, top right]
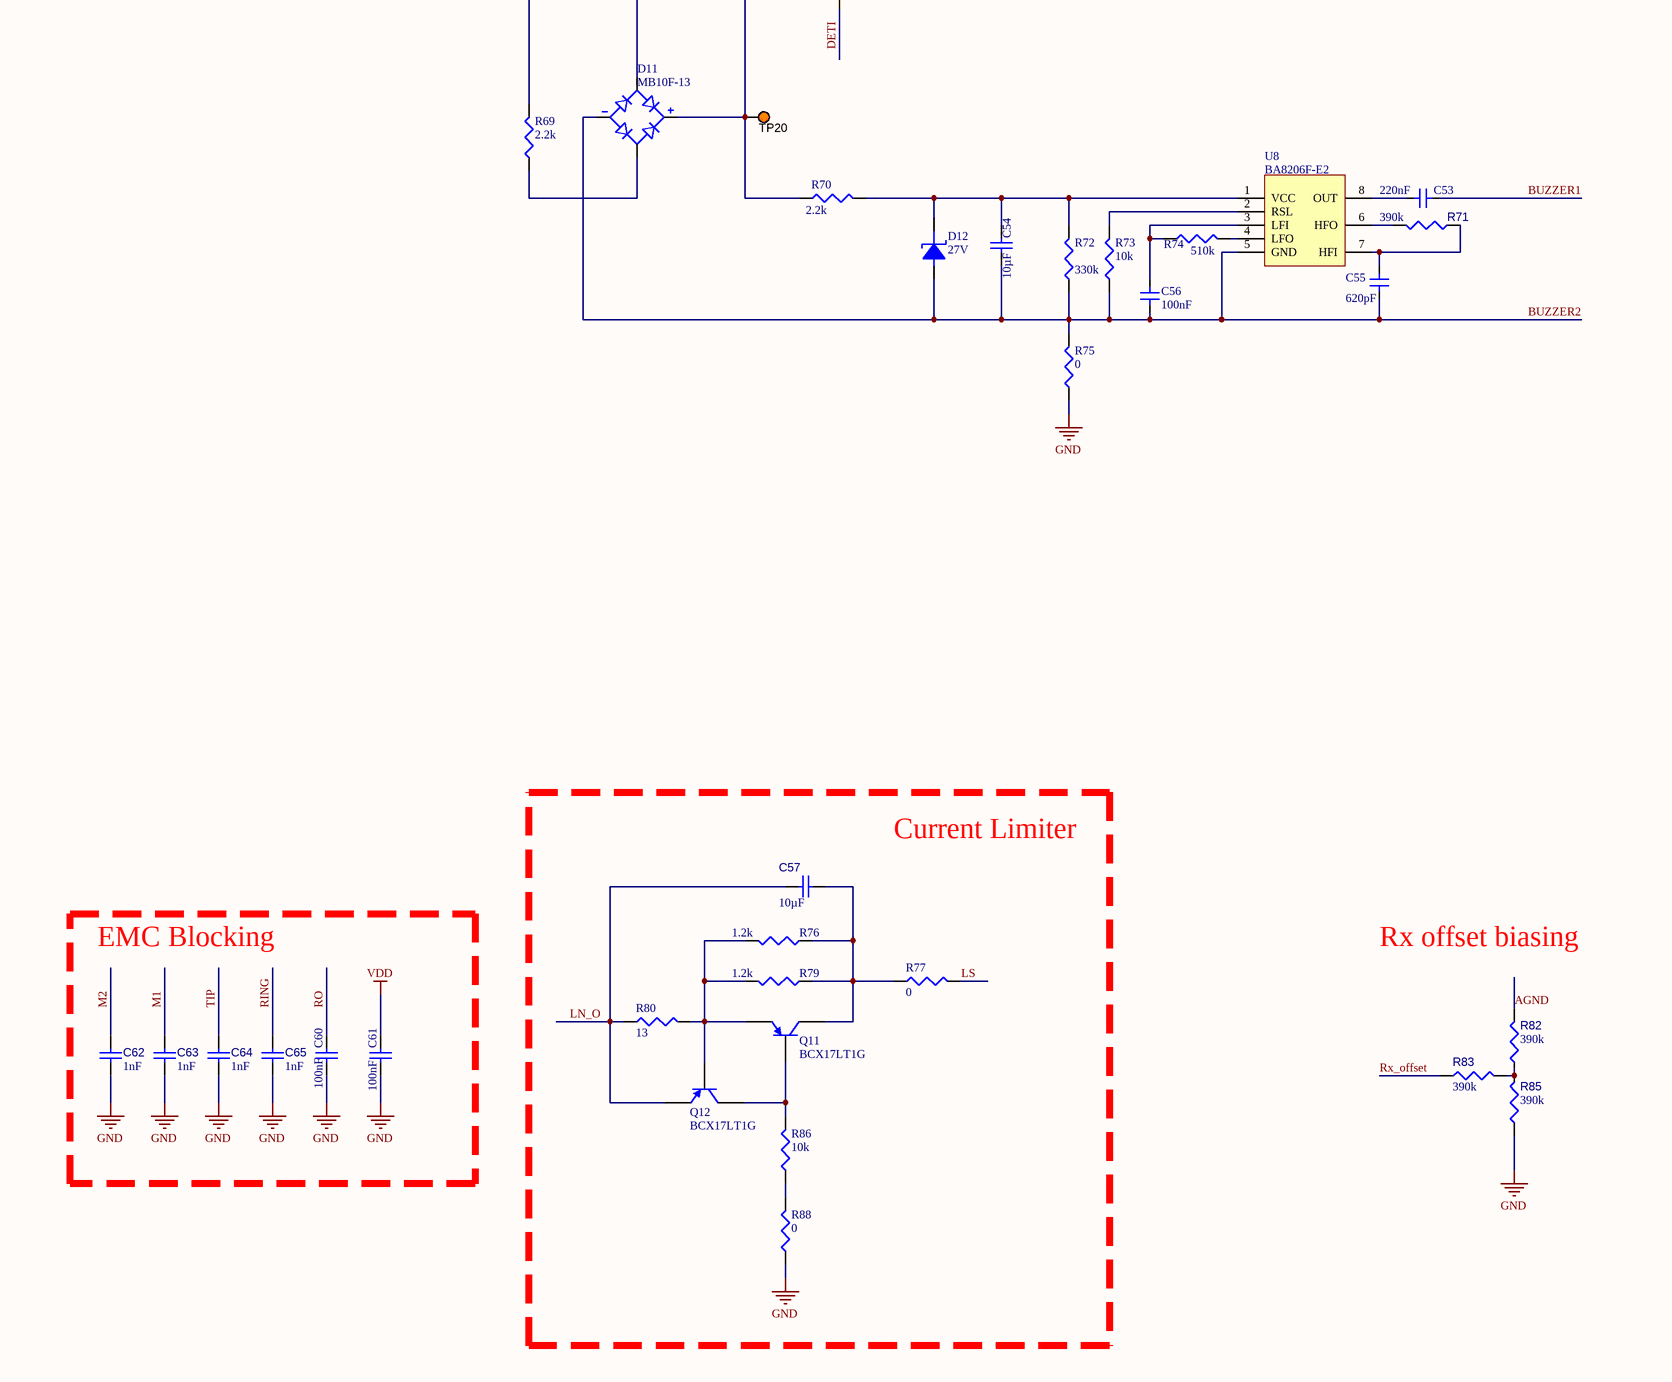
[diagram p4: Telephone.SchDoc, bottom left]
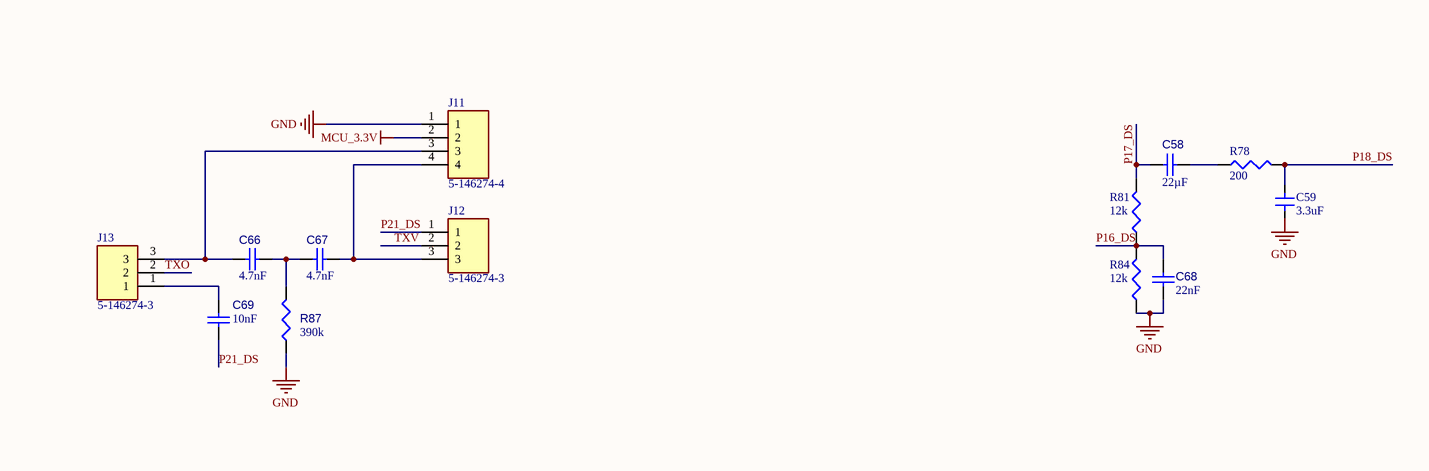
[diagram p5: Telephone.SchDoc, bottom right]

### Parts
C19  value 100uF 16V  [CAPAE6767X56M 100UF 16V]  (hidden comment: CMP-001-00187-1)
C20  value 10µF  [C1210]  (hidden comment: GRM32ER7YA106KA12L)
C21  value 220µF  [CAPAE9290X56M 220UF 6.3V]  (hidden comment: CMP-001-00174-1)
C22  value 100nF  [C0603]  (hidden comment: CC0603KRX7R8BB104)
C23  value 10µF  [C1210]  (hidden comment: GRM32ER7YA106KA12L)
C24  value 100nF  [C0603]  (hidden comment: CC0603KRX7R8BB104)
C25  value 33nF  [0805]  (hidden comment: CMP-001-00170-1)
C26  value 820nF  [C0603]  (hidden comment: CC0603KRX7R7BB824)
C27  value 100nF  [C0603]  (hidden comment: CC0603KRX7R8BB104)
C28  value 100nF  [C0603]  (hidden comment: CC0603KRX7R8BB104)
C29  value 15nF  [0805]  (hidden comment: CMP-001-00169-1)
C30  value 1uF  [C0603]  (hidden comment: CL10A105KA8NNNC)
C31  value 10nF  [C0603]  (hidden comment: 06035C103KAT2A)
C32  value 15nF  [0805]  (hidden comment: CMP-001-00169-1)
C33  value 10nF  [C0603]  (hidden comment: 06035C103KAT2A)
C34  value 100nF  [C0603]  (hidden comment: CC0603KRX7R8BB104)
C35  value 15nF  [0805]  (hidden comment: CMP-001-00169-1)
C36  value 15nF  [0805]  (hidden comment: CMP-001-00169-1)
C37  value 680nF  [C1812]  (hidden comment: 1812B684M251CT)
C38  value 22nF  [C0603]  (hidden comment: VJ0603Y223JXAAC)
C39  value 22nF  [0805]  (hidden comment: CMP-001-00184-1)
C40  value 470uF 6.3V  [CAPAE9984X105M 470UF 6.3V]  (hidden comment: CMP-001-00185-1)
C41  value 100uF 16V  [CAPAE6767X56M 100UF 16V]  (hidden comment: CMP-001-00187-1)
C42  value 100uF 16V  [CAPAE6767X56M 100UF 16V]  (hidden comment: CMP-001-00187-1)
C43  value 100uF 16V  [CAPAE6767X56M 100UF 16V]  (hidden comment: CMP-001-00187-1)
C44  value 1nF  [0603]  (hidden comment: 885342206003)
C45  value 1nF  [0603]  (hidden comment: 885342206003)
C46  value 1nF  [0603]  (hidden comment: 885342206003)
C47  value 22µF  [C0805]  (hidden comment: CL21A226KPCLRNC)
C48  value 22µF  [C0805]  (hidden comment: CL21A226KPCLRNC)
C49  value 1uF  [C0603]  (hidden comment: CL10A105KA8NNNC)
C50  value 100uF 16V  [CAPAE6767X56M 100UF 16V]  (hidden comment: CMP-001-00187-1)
C51  value 33µF  [CAPAE6342X55M 22UF 6.3V]  (hidden comment: CMP-001-00173-1)
C52  value 10nF  [C0603]  (hidden comment: 06035C103KAT2A)
C53  value 220nF  [0805]  (hidden comment: CMP-001-00181-1)
C54  value 10µF  [C1210]  (hidden comment: GRM32ER7YA106KA12L)
C55  value 620pF  [0805]  (hidden comment: CMP-001-00182-1)
C56  value 100nF  [0805]  (hidden comment: CMP-001-00168-1)
C57  value 10µF  [C1210]  (hidden comment: C1210C106M5RACTU)
C58  value 22µF  [C0805]  (hidden comment: CL21A226KPCLRNC)
C59  value 3.3uF  [0603]  (hidden comment: CMP-001-00165-1)
C60  value 100nF  [C0603]  (hidden comment: CC0603KRX7R8BB104)
C61  value 100nF  [C0603]  (hidden comment: CC0603KRX7R8BB104)
C62  value 1nF  [0603]  (hidden comment: 885342206003)
C63  value 1nF  [0603]  (hidden comment: 885342206003)
C64  value 1nF  [0603]  (hidden comment: 885342206003)
C65  value 1nF  [0603]  (hidden comment: 885342206003)
C66  value 4.7nF  [C0805]  (hidden comment: CMP-001-00190-1)
C67  value 4.7nF  [C0805]  (hidden comment: CMP-001-00190-1)
C68  value 22nF  [C0603]  (hidden comment: VJ0603Y223JXAAC)
C69  value 10nF  [C0603]  (hidden comment: 06035C103KAT2A)
D2  MB10F-13  [DIOB_MB10F-13]
D3  DSS-301L  [DSS]
D4  ZM4740A  [DIOMELF5124N]
D5  MURS140-E3/5BT  [DO-214AA-2]  (value not drawn)
D6  MURS140-E3/5BT  [DO-214AA-2]  (value not drawn)
D7  1N4148W_R1_00001  [SOD-123]  (value not drawn)
D8  1N4148W_R1_00001  [SOD-123]  (value not drawn)
D9  value 5.1V  [Zener 5.1V]  (hidden comment: DDZ5V1BS-7)
D10  value 5.1V  [Zener 5.1V]  (hidden comment: DDZ5V1BS-7)
D11  MB10F-13  [DIOB_MB10F-13]
D12  value 27V  [Diode - 27V]  (hidden comment: CMP-004-00064-1)
J3  5-146274-3  [TE_5-146274-3]  (value not drawn)
J4  5-146274-3  [TE_5-146274-3]  (value not drawn)
J5  5-146274-3  [TE_5-146274-3]  (value not drawn)
J6  5-146274-3  [TE_5-146274-3]  (value not drawn)
J7  5-146274-3  [TE_5-146274-3]  (value not drawn)
J8  5-146274-3  [TE_5-146274-3]  (value not drawn)
J9  5-146274-3  [TE_5-146274-3]  (value not drawn)
J10  5-146274-3  [TE_5-146274-3]  (value not drawn)
J11  5-146274-4  [5-146274-3]
J12  5-146274-3  [TE_5-146274-3]
J13  5-146274-3  [TE_5-146274-3]
Q4  MPSA92PBFREE  [UNIC-TO-92-3]  (value not drawn)
Q5  MPSA92PBFREE  [UNIC-TO-92-3]  (value not drawn)
Q6  BCX17LT1G  [FAIR-SOT23-3_V]
Q7  MMBT5551  [SOT23127P600-8N]
Q8  MMBT5551  [SOT23127P600-8N]
Q9  BCX17LT1G  [FAIR-SOT23-3_V]
Q10  MMBT5551  [SOT23127P600-8N]
Q11  BCX17LT1G  [FAIR-SOT23-3_V]
Q12  BCX17LT1G  [FAIR-SOT23-3_V]
R22  value 1.5k  [0805]  (hidden comment: CMP-009-00298-1)
R23  value 1.8k  [0805]  (hidden comment: CMP-009-00299-1)
R24  value 2.2k  [0805]  (hidden comment: CMP-009-00296-1)
R25  value 0  [R0603]  (hidden comment: RMCF0603ZT0R00)
R26  value 10  [R2512]  (hidden comment: 1-2176230-4)
R27  value 20k  [BOUR-TC33X-2_V]  (hidden comment: TC33X-2-203E)
R28  value 0  [R0603]  (hidden comment: RMCF0603ZT0R00)
R29  value 1.2k  [0805]  (hidden comment: CMP-009-00289-1)
R30  value 1.2k  [0805]  (hidden comment: CMP-009-00289-1)
R31  value 30  [0603]  (hidden comment: CMP-009-00303-1)
R32  value 10  [R2512]  (hidden comment: 1-2176230-4)
R33  value 2k  [0805]  (hidden comment: CMP-009-00295-1)
R34  value 100k  [R0805]  (hidden comment: RC0805FR-07100KL)
R35  value 1.2k  [0805]  (hidden comment: CMP-009-00289-1)
R36  value 300  [0805]  (hidden comment: CMP-009-00293-1)
R37  value 10k  [R0603]  (hidden comment: CRCW060310K0JNEA)
R38  value 8.2k  [0805]  (hidden comment: CMP-009-00302-1)
R39  value 1.2k  [0805]  (hidden comment: CMP-009-00289-1)
R40  value 2.7k  [0805]  (hidden comment: CMP-009-00292-1)
R41  value 470k  [0805]  (hidden comment: CMP-009-00316-1)
R42  value 82k  [0805]  (hidden comment: CMP-009-00311-1)
R43  value 1.8k  [0805]  (hidden comment: CMP-009-00299-1)
R44  value 20k  [BOUR-TC33X-2_V]  (hidden comment: TC33X-2-203E)
R45  value 330k  [0805]  (hidden comment: CMP-009-00308-1)
R46  value 82k  [0805]  (hidden comment: CMP-009-00311-1)
R47  value 10k  [R0603]  (hidden comment: CRCW060310K0JNEA)
R48  value 12k  [0805]  (hidden comment: CMP-009-00306-1)
R49  value 10k  [R0603]  (hidden comment: CRCW060310K0JNEA)
R50  value 18k  [R0805]  (hidden comment: CMP-009-00321-1)
R51  value 18k  [R0805]  (hidden comment: CMP-009-00321-1)
R52  value 20k  [BOUR-TC33X-2_V]  (hidden comment: TC33X-2-203E)
R53  value 1 M  [0805]  (hidden comment: CMP-009-00300-1)
R54  value 1 M  [0805]  (hidden comment: CMP-009-00300-1)
R55  value 680  [R0805]  (hidden comment: CRCW0805680RJNEBC)
R56  value 0  [R0603]  (hidden comment: RMCF0603ZT0R00)
R57  value 0  [0805]  (hidden comment: CMP-009-00305-1)
R58  value 0  [R0603]  (hidden comment: RMCF0603ZT0R00)
R59  value 10  [R0603]  (hidden comment: CRCW060310R0FKEAHP)
R60  value 10  [R0603]  (hidden comment: CRCW060310R0FKEAHP)
R61  value 10  [R0603]  (hidden comment: CRCW060310R0FKEAHP)
R62  value 1.5M  [0805]  (hidden comment: CMP-009-00294-1)
R63  value 18k  [R0805]  (hidden comment: CMP-009-00321-1)
R64  value 47k  [0805]  (hidden comment: CMP-009-00314-1)
R65  value 0  [R0603]  (hidden comment: RMCF0603ZT0R00)
R66  value 330k  [0805]  (hidden comment: CMP-009-00308-1)
R67  value 330k  [0805]  (hidden comment: CMP-009-00308-1)
R68  value 0  [R0603]  (hidden comment: RMCF0603ZT0R00)
R69  value 2.2k  [0805]  (hidden comment: CMP-009-00315-1)
R70  value 2.2k  [0805]  (hidden comment: CMP-009-00296-1)
R71  value 390k  [R0805]  (hidden comment: CMP-009-00320-1)
R72  value 330k  [0805]  (hidden comment: CMP-009-00308-1)
R73  value 10k  [R0603]  (hidden comment: CRCW060310K0JNEA)
R74  value 510k  [0805]  (hidden comment: CMP-009-00309-1)
R75  value 0  [R0603]  (hidden comment: RMCF0603ZT0R00)
R76  value 1.2k  [0805]  (hidden comment: CMP-009-00289-1)
R77  value 0  [R0603]  (hidden comment: RMCF0603ZT0R00)
R78  value 200  [0805]  (hidden comment: CMP-009-00291-1)
R79  value 1.2k  [0805]  (hidden comment: CMP-009-00289-1)
R80  value 13  [0805]  (hidden comment: CMP-009-00290-1)
R81  value 12k  [0805]  (hidden comment: CMP-009-00306-1)
R82  value 390k  [R0805]  (hidden comment: CMP-009-00320-1)
R83  value 390k  [R0805]  (hidden comment: CMP-009-00320-1)
R84  value 12k  [0805]  (hidden comment: CMP-009-00306-1)
R85  value 390k  [R0805]  (hidden comment: CMP-009-00320-1)
R86  value 10k  [R0603]  (hidden comment: CRCW060310K0JNEA)
R87  value 390k  [R0805]  (hidden comment: CMP-009-00320-1)
R88  value 0  [R0603]  (hidden comment: RMCF0603ZT0R00)
TP6  5003  [KSTN-5003]  (value not drawn)
TP7  5003  [KSTN-5003]  (value not drawn)
TP8  5003  [KSTN-5003]  (value not drawn)
TP9  5003  [KSTN-5003]  (value not drawn)
TP10  5003  [KSTN-5003]  (value not drawn)
TP11  5003  [KSTN-5003]  (value not drawn)
TP12  5003  [KSTN-5003]  (value not drawn)
TP13  5003  [KSTN-5003]  (value not drawn)
TP14  5003  [KSTN-5003]  (value not drawn)
TP15  5003  [KSTN-5003]  (value not drawn)
TP16  5003  [KSTN-5003]  (value not drawn)
TP17  5003  [KSTN-5003]  (value not drawn)
TP18  5003  [KSTN-5003]  (value not drawn)
TP19  5003  [KSTN-5003]  (value not drawn)
TP20  5003  [KSTN-5003]  (value not drawn)
U6  AS2523-T  [AS2523]
U7  PC817XI  [SOIC254P975X460-4N]
U8  BA8206F-E2  [BA8206]

### Blocks framed on the sheet
Current Limiter: C57 Q11 Q12 R76 R77 R79 R80 R86 R88
EMC Blocking: C60-C65

### Ports
BUZZER1 (out), BUZZER2 (out), CLK/HFI (in), DETI (out), DI/xPD (in), DPN (in), FCI (out), HF (out), HF_MIC1 (out), HF_MIC2 (out), HS (out), HS_2 (out), HS_MIC1 (out), HS_MIC2 (out), HS_SP1 (out), RING (out), SP1 (out), TIP (out), TONE_IN (in), xCS/xMUTE (in)

### Nets
+3V3: R47.2
GND: C19.2 C20.2 C21.2 C33.1 C35.1 C36.1 C39.1 C40.2 C43.2 C44.1 C45.1 C46.1 C48.1 C49.1 C50.2 C51.2 C52.1 C59.2 C60.1 C61.1 C62.1 C63.1 C64.1 C65.1 C68.1 D2.3(NEG) D4.A D9.2 D10.2 J11.1 Q6.3(C) Q7.1(E) Q8.1(E) R27.3 R35.1 R39.1 R44.3 R45.1 R48.1 R49.1 R50.1 R52.3 R53.1 R54.1 R65.1 R67.1 R75.1 R84.1 R85.1 R87.1 R88.1 U6.11(VSS) U6.24(VSSA) U7.3(ET)
MCU_3.3V: J11.2
VDD: C47.2 C50.1 C61.2 D8.1(K) D10.1 Q10.1(E) R62.2 TP19.1 U6.18(VDD)
VPP: C40.1 Q9.3(C) R58.2 U6.22(VPP)
AGND: C48.2 R82.2 U6.19(AGND)
BUZZER1: C53.2 ; port BUZZER1
BUZZER2: C54.1 C55.1 C56.2 D11.3(NEG) D12.2 R72.1 R73.1 R75.2 U8.5(GND) ; port BUZZER2
CLK/HFI: C46.2 R61.2 TP18.1 ; port CLK/HFI
DETI: R68.1 ; port DETI
DI/xPD: C45.2 R60.2 TP17.1 ; port DI/xPD
DPN: R46.1 ; port DPN
FCI: R47.1 TP14.1 U7.4(CT) ; port FCI
HF: D5.2(A) R54.2 ; port HF
HF_MIC1: C24.2 R29.1 R33.2 ; port HF_MIC1
HF_MIC2: C28.1 J5.1 J5.2 R35.2 ; port HF_MIC2
HS: D6.2(A) R53.2 ; port HS
HS_2: D2.1(POS) Q4.1(E) R34.1 R62.1 ; port HS_2
HS_MIC1: C29.2 R30.1 R38.2 ; port HS_MIC1
HS_MIC2: C32.2 R38.1 R39.2 ; port HS_MIC2
HS_SP1: J9.3 ; port HS_SP1
LN_O: C57.1 Q4.3(C) Q5.3(C) Q12.2(E) R28.1 R80.1
LS: C23.2 D4.C(K) J3.2 R28.2 R31.2 R77.2 TP8.1 U6.15(LS)
M1: C29.1 C31.2 C63.2 U6.8(M1)
M2: C31.1 C32.1 C62.2 U6.6(M2)
P14_DS: J6.1 R43.2
P16_DS: C68.2 J10.3 R81.1 R84.2
P17_DS: C58.2 J7.1 J8.1 R81.2
P18_DS: C59.1 J9.1 R78.2
P21_DS: C69.1 J12.1
RING: C65.2 D3.1 R32.1 TP9.1 ; port RING
RO: C60.2 J8.2 R44.1 R52.1 U6.17(RO)
Rx_offset: C38.1 R83.1 U6.21(RECV1)
SP1: R56.2 ; port SP1
TIP: C64.2 D3.2 R26.1 TP7.1 ; port TIP
TONE_IN: R25.1 ; port TONE_IN
TXO: J13.2 U6.3(TXO)
TXV: J12.2 U6.4(TXV)
xCS/xMUTE: C44.2 R59.2 TP16.1 ; port xCS/xMUTE
NetC19_1: C19.1 R23.1
NetC20_1: C20.1 R22.1
NetC21_1: C21.1 R24.2 R29.2 R30.2
NetC22_1: C22.1 TP6.1 U6.28(TONE_IN)
NetC22_2: C22.2 R27.2
NetC23_1: C23.1 U6.13(RI)
NetC24_1: C24.1 J4.2 U6.7(M3)
NetC25_1: C25.1 C26.1 C27.1 C28.2 U6.5(M4)
NetC25_2: C25.2 J4.1
NetC26_2: C26.2 C27.2 J4.3
NetC30_1: C30.1 U6.9(STB)
NetC30_2: C30.2 J6.2 R36.1 TP11.1
NetC33_2: C33.2 U6.16(CI)
NetC34_1: C34.1 U6.20(REC1)
NetC34_2: C34.2 J7.2
NetC35_2: C35.2 R43.1 R48.2
NetC36_2: C36.2 R40.1 R49.2
NetC37_1: C37.1 R51.1 R69.2
NetC37_2: C37.2 D2.4(AC2) R32.2
NetC38_2: C38.2 J10.2
NetC39_2: C39.2 J10.1 R52.2
NetC41_1: C41.1 C43.1 R55.2
NetC41_2: C41.2 J9.2
NetC42_1: C42.1 TP15.1 U6.23(LO)
NetC42_2: C42.2 R56.1
NetC47_1: C47.1 D9.1 Q10.2(B) R63.1
NetC49_2: C49.2 U6.2(FT1)
NetC51_1: C51.1 R64.2 U6.1(CBN)
NetC52_2: C52.2 R66.1 R67.2 R68.2
NetC53_1: C53.1 U8.8(OUT)
NetC54_2: C54.2 D12.1 R70.2 R72.2 U8.1(VCC)
NetC55_2: C55.2 R71.1 U8.7(HFI)
NetC56_1: C56.1 R74.1 U8.3(LFI)
NetC57_2: C57.2 Q11.3(C) R76.1 R77.1 R79.1
NetC58_1: C58.1 R78.1
NetC66_1: C66.1 J11.3 J13.3
NetC66_2: C66.2 C67.1 R87.2
NetC67_2: C67.2 J11.4 J12.3
NetC69_2: C69.2 J13.1
NetD2_2: D2.2(AC1) D7.2(A) R26.2 R57.2 U7.2(C)
NetD5_1: D5.1(K) D6.1(K) R41.1
NetD7_1: D7.1(K) R51.2 TP13.1 U7.1(A)
NetD8_2: D8.2(A) R58.1
NetD11_1: D11.1(POS) Q10.3(C) R63.2 R66.2 R70.1 TP20.1
NetD11_2: D11.2(AC1) R57.1
NetD11_4: D11.4(AC2) R69.1
NetJ3_1: J3.1 R22.2
NetJ3_3: J3.3 R23.2
NetJ5_3: J5.3 R33.1
NetJ6_3: J6.3 R40.2 R50.2
NetJ7_3: J7.3 R44.2
NetJ8_3: J8.3 R55.1
NetQ4_2: Q4.2(B) Q5.1(E)
NetQ5_2: Q5.2(B) R34.2 R37.2 TP10.1
NetQ6_1: Q6.1(B) U6.10(CS)
NetQ6_2: Q6.2(E) Q9.2(E) R24.1 R31.1 R36.2 U6.12(LI)
NetQ7_2: Q7.2(B) R42.2 R45.2
NetQ7_3: Q7.3(C) Q8.3(C) R37.1
NetQ8_2: Q8.2(B) R46.2
NetQ9_1: Q9.1(B) U6.14(SS)
NetQ11_1: Q11.1(B) Q12.3(C) R86.2
NetQ11_2: Q11.2(E) Q12.1(B) R76.2 R79.2 R80.2
NetR25_2: R25.2 R27.1
NetR41_2: R41.2 R42.1 TP12.1
NetR59_1: R59.1 U6.25(xCS/xMUTE)
NetR60_1: R60.1 U6.26(DI/xPD)
NetR61_1: R61.1 U6.27(CLK/HEI)
NetR64_1: R64.1 R65.2
NetR71_2: R71.2 U8.6(HFO)
NetR73_2: R73.2 U8.2(RSL)
NetR74_2: R74.2 U8.4(LFO)
NetR82_1: R82.1 R83.2 R85.2
NetR86_1: R86.1 R88.2

### Notes on the sheet
- (near Q4) MMBTA92(SMD)
- uC ring detect circuit
- Rx offset biasing
- Title:
- Page Contents:
- Drawn By:
- Size:
- A2
- DWG:
- Revision:
- Checked By:
- Date:
- Email:
- Time:
- Sheet
- of
- Website:
- (in symbol CMP-001-00174-1) +
- (in symbol CMP-001-00185-1) +
- (in symbol CMP-001-00187-1) +